# Altium schematic sheet AD.SchDoc
size 203 x 152 mm
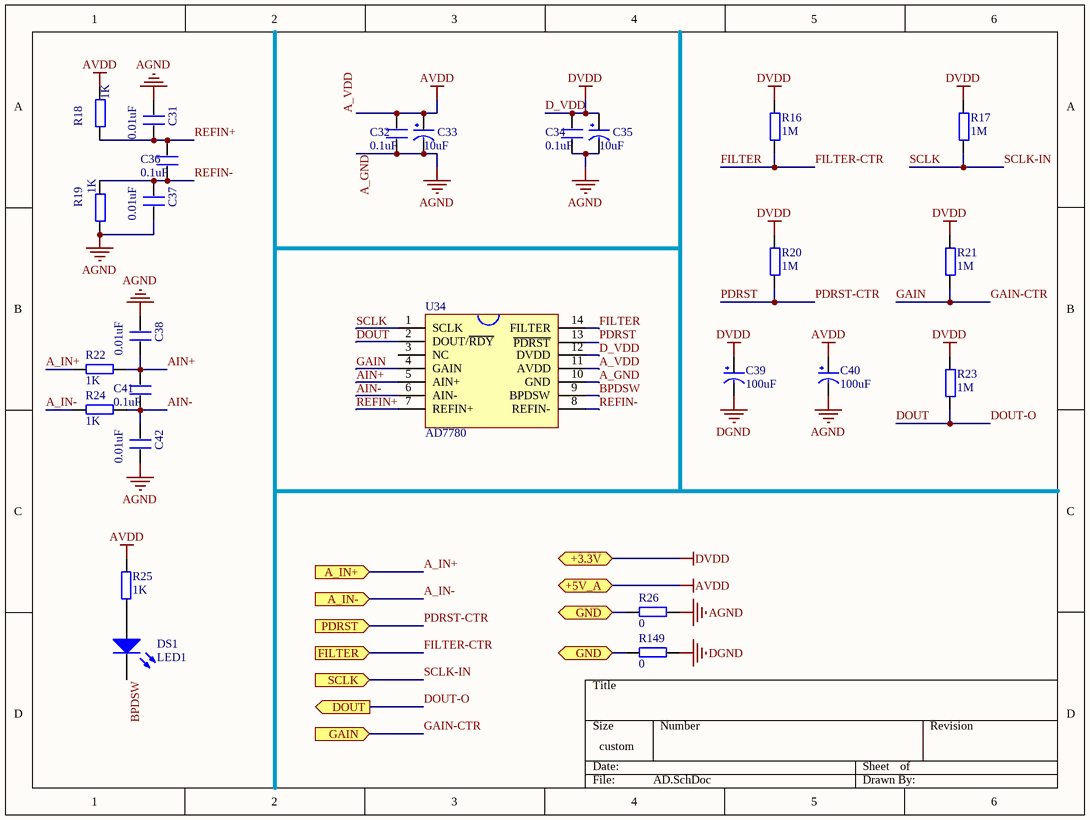
[diagram p0: AD.SchDoc]

## Parts
C31  0.01uF  [0603P]
C32  0.1uF  [0603P]
C33  10uF  [CC6.56.5]
C34  0.1uF  [0603P]
C35  10uF  [CC6.56.5]
C36  0.1uF  [0603P]
C37  0.01uF  [0603P]
C38  0.01uF  [0603P]
C39  100uF  [CC6.56.5]
C40  100uF  [CC6.56.5]
C41  0.1uF  [0603P]
C42  0.01uF  [0603P]
DS1  LED1  [SMDLED]
R16  1M  [0603P]
R17  1M  [0603P]
R18  1K  [0603P]
R19  1K  [0603P]
R20  1M  [0603P]
R21  1M  [0603P]
R22  1K  [0603P]
R23  1M  [0603P]
R24  1K  [0603P]
R25  1K  [0603P]
R26  0  [0603P]
R149  0  [0603P]
U34  AD7780  [SOIC_14]

## Ports
+3.3V, +5V_A, A_IN+ (in), A_IN- (in), DOUT (out), FILTER (in), GAIN (in), GND, PDRST (in), SCLK (in)

## Nets
A_GND: C31.2 C32.1 C33.2(GND) C34.1 C35.2(GND) C37.1 C38.2 C40.2(GND) C42.1 R19.1 R26.1 U34.10(GND)  [also labelled AGND]
A_VDD: C32.2 C33.1(VCC) C40.1(VCC) R18.2 R25.1 U34.11(AVDD) ; port +5V_A  [also labelled AVDD]
D_VDD: C34.2 C35.1(VCC) C39.1(VCC) R16.2 R17.2 R20.2 R21.2 R23.2 U34.12(DVDD) ; port +3.3V  [also labelled DVDD]
DGND: C39.2(GND) R149.1
A_IN+: R22.2 ; port A_IN+
A_IN-: R24.2 ; port A_IN-
AIN+: C38.1 C41.2 R22.1 U34.5(AIN+)
AIN-: C41.1 C42.2 R24.1 U34.6(AIN-)
BPDSW: DS1.2(K) U34.9(BPDSW)
DOUT: R23.1 U34.2(DOUT/~{RDY}) ; port DOUT  [also labelled DOUT-O]
FILTER: R16.1 U34.14(FILTER) ; port FILTER  [also labelled FILTER-CTR]
GAIN: R21.1 U34.4(GAIN) ; port GAIN  [also labelled GAIN-CTR]
GND: R26.2 R149.2 ; port GND
PDRST: R20.1 U34.13(~{PDRST}) ; port PDRST  [also labelled PDRST-CTR]
REFIN+: C31.1 C36.2 R18.1 U34.7(REFIN+)
REFIN-: C36.1 C37.2 R19.2 U34.8(REFIN-)
SCLK: R17.1 U34.1(SCLK) ; port SCLK  [also labelled SCLK-IN]
NetDS1_1: DS1.1(A) R25.2

Not connected (* = marked no-connect by the designer): U34 3(NC)

## Library data of the parts
C31 C32 C34 C36-C38 C41 C42 = C
C33 C35 C39 C40 = CAP
DS1 = LED2: Typical RED, GREEN, YELLOW, AMBER GaAs LED; Published: 8-Jun-2000; LatestRevisionDate: 17-Jul-2002; LatestRevisionNote: Re-released for DXP Platform.; PackageDocument: Feb-2002; PackageReference: 3.2X1.6X1.1; Publisher: Altium Limited
R16-R26 R149 = R